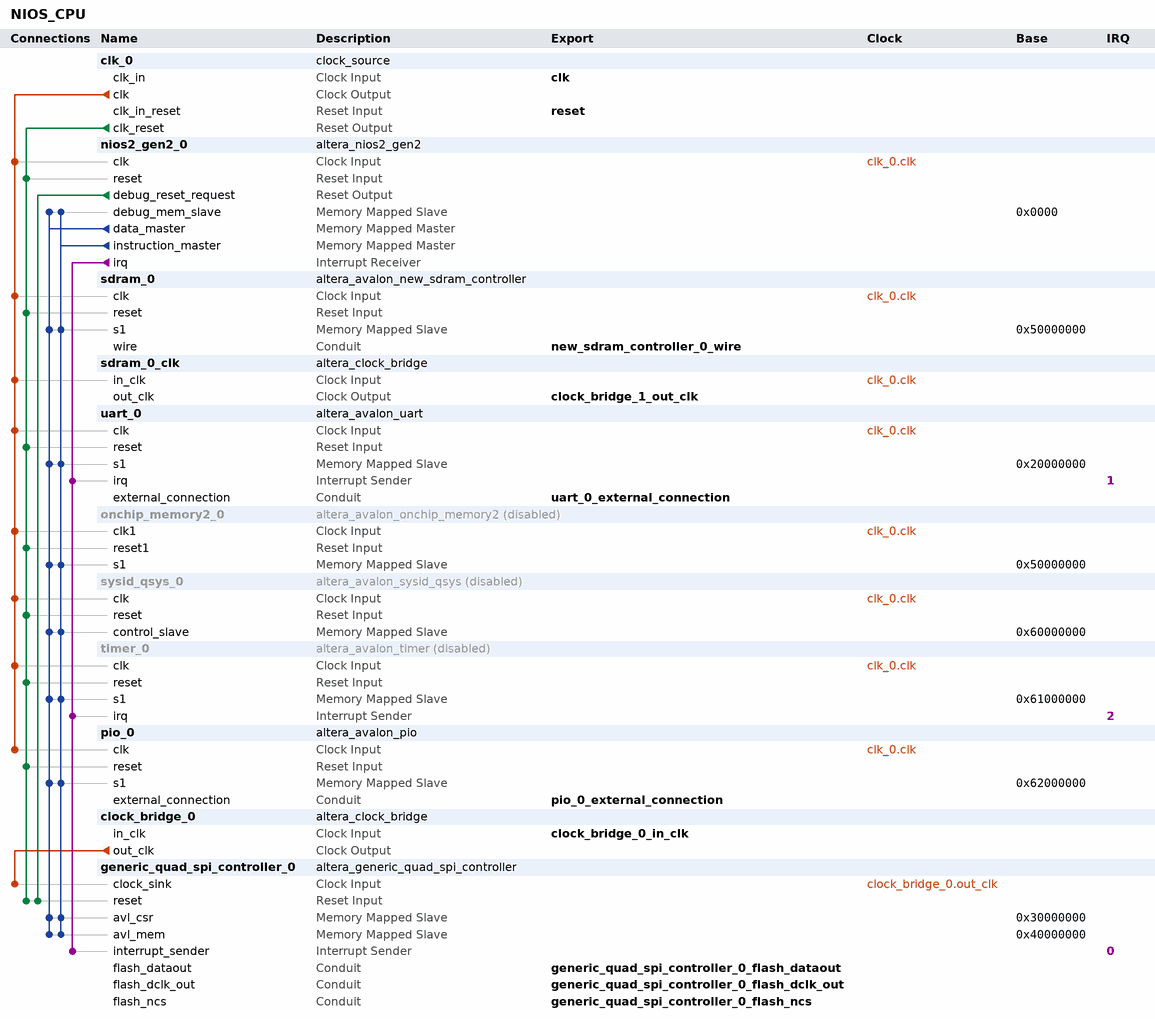
[diagram p0: system contents]
# Platform Designer (Qsys) system NIOS_CPU, MAX 10 10M04SCE144C8G
# Parameters at their usual value, and those the tool derives, are not listed.
package require -exact qsys 16.0
create_system NIOS_CPU
set_project_property DEVICE_FAMILY {MAX 10}
set_project_property DEVICE 10M04SCE144C8G

add_instance clk_0 clock_source 16.0
set_instance_parameter_value clk_0 clockFrequency 90000000

add_instance nios2_gen2_0 altera_nios2_gen2 16.0
set_instance_parameter_value nios2_gen2_0 dcache_size 2048
set_instance_parameter_value nios2_gen2_0 exceptionOffset 288
set_instance_parameter_value nios2_gen2_0 exceptionSlave sdram_0.s1
set_instance_parameter_value nios2_gen2_0 icache_size 4096
set_instance_parameter_value nios2_gen2_0 impl Tiny
set_instance_parameter_value nios2_gen2_0 resetSlave generic_quad_spi_controller_0.avl_mem

add_instance sdram_0 altera_avalon_new_sdram_controller 16.0
set_instance_parameter_value sdram_0 TAC 5.5
set_instance_parameter_value sdram_0 TRCD 20.0
set_instance_parameter_value sdram_0 TRP 20.0
set_instance_parameter_value sdram_0 casLatency 3
set_instance_parameter_value sdram_0 columnWidth 9
set_instance_parameter_value sdram_0 dataWidth 16
set_instance_parameter_value sdram_0 generateSimulationModel false
set_instance_parameter_value sdram_0 model single_Micron_MT48LC4M32B2_7_chip
set_instance_parameter_value sdram_0 numberOfBanks 4
set_instance_parameter_value sdram_0 numberOfChipSelects 1
set_instance_parameter_value sdram_0 powerUpDelay 100.0
set_instance_parameter_value sdram_0 refreshPeriod 15.625
set_instance_parameter_value sdram_0 rowWidth 12

add_instance sdram_0_clk altera_clock_bridge 16.0
set_instance_parameter_value sdram_0_clk DERIVED_CLOCK_RATE 90000000
set_instance_parameter_value sdram_0_clk EXPLICIT_CLOCK_RATE 0

add_instance uart_0 altera_avalon_uart 16.0
set_instance_parameter_value uart_0 baud 115200
set_instance_parameter_value uart_0 dataBits 8
set_instance_parameter_value uart_0 fixedBaud true
set_instance_parameter_value uart_0 parity NONE
set_instance_parameter_value uart_0 stopBits 1

add_instance onchip_memory2_0 altera_avalon_onchip_memory2 16.0
set_instance_property onchip_memory2_0 ENABLED false
set_instance_parameter_value onchip_memory2_0 blockType M9K
set_instance_parameter_value onchip_memory2_0 dataWidth 32
set_instance_parameter_value onchip_memory2_0 dualPort false
set_instance_parameter_value onchip_memory2_0 initMemContent false
set_instance_parameter_value onchip_memory2_0 initializationFileName "E:\\hong\\geminiboard\\FPGA\\HDMITest\\PRJ\\Software\\test17\\mem_init\\NIOS_CPU_onchip_memory2_0.hex"
set_instance_parameter_value onchip_memory2_0 memorySize 4096

add_instance sysid_qsys_0 altera_avalon_sysid_qsys 16.0
set_instance_property sysid_qsys_0 ENABLED false
set_instance_parameter_value sysid_qsys_0 id 1610612736

add_instance timer_0 altera_avalon_timer 16.0
set_instance_property timer_0 ENABLED false
set_instance_parameter_value timer_0 period 1
set_instance_parameter_value timer_0 periodUnits MSEC

add_instance pio_0 altera_avalon_pio 16.0
set_instance_parameter_value pio_0 direction Output
set_instance_parameter_value pio_0 width 28

add_instance clock_bridge_0 altera_clock_bridge 16.0
set_instance_parameter_value clock_bridge_0 DERIVED_CLOCK_RATE 0
set_instance_parameter_value clock_bridge_0 EXPLICIT_CLOCK_RATE 0

add_instance generic_quad_spi_controller_0 altera_generic_quad_spi_controller 16.0
set_instance_parameter_value generic_quad_spi_controller_0 CHIP_SELS 1
set_instance_parameter_value generic_quad_spi_controller_0 FLASH_TYPE N25Q32
set_instance_parameter_value generic_quad_spi_controller_0 IO_MODE QUAD
set_instance_parameter_value generic_quad_spi_controller_0 clkFreq 0

# connections
add_connection clk_0.clk nios2_gen2_0.clk clock
add_connection clk_0.clk onchip_memory2_0.clk1 clock
add_connection clk_0.clk pio_0.clk clock
add_connection clk_0.clk sdram_0.clk clock
add_connection clk_0.clk sdram_0_clk.in_clk clock
add_connection clk_0.clk sysid_qsys_0.clk clock
add_connection clk_0.clk timer_0.clk clock
add_connection clk_0.clk uart_0.clk clock
add_connection clock_bridge_0.out_clk generic_quad_spi_controller_0.clock_sink clock
add_connection clk_0.clk_reset generic_quad_spi_controller_0.reset reset
add_connection clk_0.clk_reset nios2_gen2_0.reset reset
add_connection clk_0.clk_reset onchip_memory2_0.reset1 reset
add_connection clk_0.clk_reset pio_0.reset reset
add_connection clk_0.clk_reset sdram_0.reset reset
add_connection clk_0.clk_reset sysid_qsys_0.reset reset
add_connection clk_0.clk_reset timer_0.reset reset
add_connection clk_0.clk_reset uart_0.reset reset
add_connection nios2_gen2_0.debug_reset_request generic_quad_spi_controller_0.reset reset
add_connection nios2_gen2_0.data_master generic_quad_spi_controller_0.avl_csr avalon
set_connection_parameter_value nios2_gen2_0.data_master/generic_quad_spi_controller_0.avl_csr baseAddress 0x30000000
add_connection nios2_gen2_0.data_master generic_quad_spi_controller_0.avl_mem avalon
set_connection_parameter_value nios2_gen2_0.data_master/generic_quad_spi_controller_0.avl_mem baseAddress 0x40000000
add_connection nios2_gen2_0.data_master nios2_gen2_0.debug_mem_slave avalon
set_connection_parameter_value nios2_gen2_0.data_master/nios2_gen2_0.debug_mem_slave baseAddress 0x0000
add_connection nios2_gen2_0.data_master onchip_memory2_0.s1 avalon
set_connection_parameter_value nios2_gen2_0.data_master/onchip_memory2_0.s1 baseAddress 0x50000000
add_connection nios2_gen2_0.data_master pio_0.s1 avalon
set_connection_parameter_value nios2_gen2_0.data_master/pio_0.s1 baseAddress 0x62000000
add_connection nios2_gen2_0.data_master sdram_0.s1 avalon
set_connection_parameter_value nios2_gen2_0.data_master/sdram_0.s1 baseAddress 0x50000000
add_connection nios2_gen2_0.data_master sysid_qsys_0.control_slave avalon
set_connection_parameter_value nios2_gen2_0.data_master/sysid_qsys_0.control_slave baseAddress 0x60000000
add_connection nios2_gen2_0.data_master timer_0.s1 avalon
set_connection_parameter_value nios2_gen2_0.data_master/timer_0.s1 baseAddress 0x61000000
add_connection nios2_gen2_0.data_master uart_0.s1 avalon
set_connection_parameter_value nios2_gen2_0.data_master/uart_0.s1 baseAddress 0x20000000
add_connection nios2_gen2_0.instruction_master generic_quad_spi_controller_0.avl_csr avalon
set_connection_parameter_value nios2_gen2_0.instruction_master/generic_quad_spi_controller_0.avl_csr baseAddress 0x30000000
add_connection nios2_gen2_0.instruction_master generic_quad_spi_controller_0.avl_mem avalon
set_connection_parameter_value nios2_gen2_0.instruction_master/generic_quad_spi_controller_0.avl_mem baseAddress 0x40000000
add_connection nios2_gen2_0.instruction_master nios2_gen2_0.debug_mem_slave avalon
set_connection_parameter_value nios2_gen2_0.instruction_master/nios2_gen2_0.debug_mem_slave baseAddress 0x0000
add_connection nios2_gen2_0.instruction_master onchip_memory2_0.s1 avalon
set_connection_parameter_value nios2_gen2_0.instruction_master/onchip_memory2_0.s1 baseAddress 0x50000000
add_connection nios2_gen2_0.instruction_master pio_0.s1 avalon
set_connection_parameter_value nios2_gen2_0.instruction_master/pio_0.s1 baseAddress 0x62000000
add_connection nios2_gen2_0.instruction_master sdram_0.s1 avalon
set_connection_parameter_value nios2_gen2_0.instruction_master/sdram_0.s1 baseAddress 0x50000000
add_connection nios2_gen2_0.instruction_master sysid_qsys_0.control_slave avalon
set_connection_parameter_value nios2_gen2_0.instruction_master/sysid_qsys_0.control_slave baseAddress 0x60000000
add_connection nios2_gen2_0.instruction_master timer_0.s1 avalon
set_connection_parameter_value nios2_gen2_0.instruction_master/timer_0.s1 baseAddress 0x61000000
add_connection nios2_gen2_0.instruction_master uart_0.s1 avalon
set_connection_parameter_value nios2_gen2_0.instruction_master/uart_0.s1 baseAddress 0x20000000
add_connection nios2_gen2_0.irq generic_quad_spi_controller_0.interrupt_sender interrupt
set_connection_parameter_value nios2_gen2_0.irq/generic_quad_spi_controller_0.interrupt_sender irqNumber 0
add_connection nios2_gen2_0.irq timer_0.irq interrupt
set_connection_parameter_value nios2_gen2_0.irq/timer_0.irq irqNumber 2
add_connection nios2_gen2_0.irq uart_0.irq interrupt
set_connection_parameter_value nios2_gen2_0.irq/uart_0.irq irqNumber 1

# exported interfaces
add_interface clk clock sink
set_interface_property clk EXPORT_OF clk_0.clk_in
add_interface clock_bridge_0_in_clk clock sink
set_interface_property clock_bridge_0_in_clk EXPORT_OF clock_bridge_0.in_clk
add_interface clock_bridge_1_out_clk clock source
set_interface_property clock_bridge_1_out_clk EXPORT_OF sdram_0_clk.out_clk
add_interface generic_quad_spi_controller_0_flash_dataout conduit end
set_interface_property generic_quad_spi_controller_0_flash_dataout EXPORT_OF generic_quad_spi_controller_0.flash_dataout
add_interface generic_quad_spi_controller_0_flash_dclk_out conduit end
set_interface_property generic_quad_spi_controller_0_flash_dclk_out EXPORT_OF generic_quad_spi_controller_0.flash_dclk_out
add_interface generic_quad_spi_controller_0_flash_ncs conduit end
set_interface_property generic_quad_spi_controller_0_flash_ncs EXPORT_OF generic_quad_spi_controller_0.flash_ncs
add_interface new_sdram_controller_0_wire conduit end
set_interface_property new_sdram_controller_0_wire EXPORT_OF sdram_0.wire
add_interface pio_0_external_connection conduit end
set_interface_property pio_0_external_connection EXPORT_OF pio_0.external_connection
add_interface reset reset sink
set_interface_property reset EXPORT_OF clk_0.clk_in_reset
add_interface uart_0_external_connection conduit end
set_interface_property uart_0_external_connection EXPORT_OF uart_0.external_connection

set_interconnect_requirement {$system} qsys_mm.clockCrossingAdapter HANDSHAKE
set_interconnect_requirement {$system} qsys_mm.insertDefaultSlave FALSE
set_interconnect_requirement {$system} qsys_mm.maxAdditionalLatency 1

save_system NIOS_CPU.qsys
